# EAGLE design dc_q84_v2 v1 (EAGLE 9.7.0)
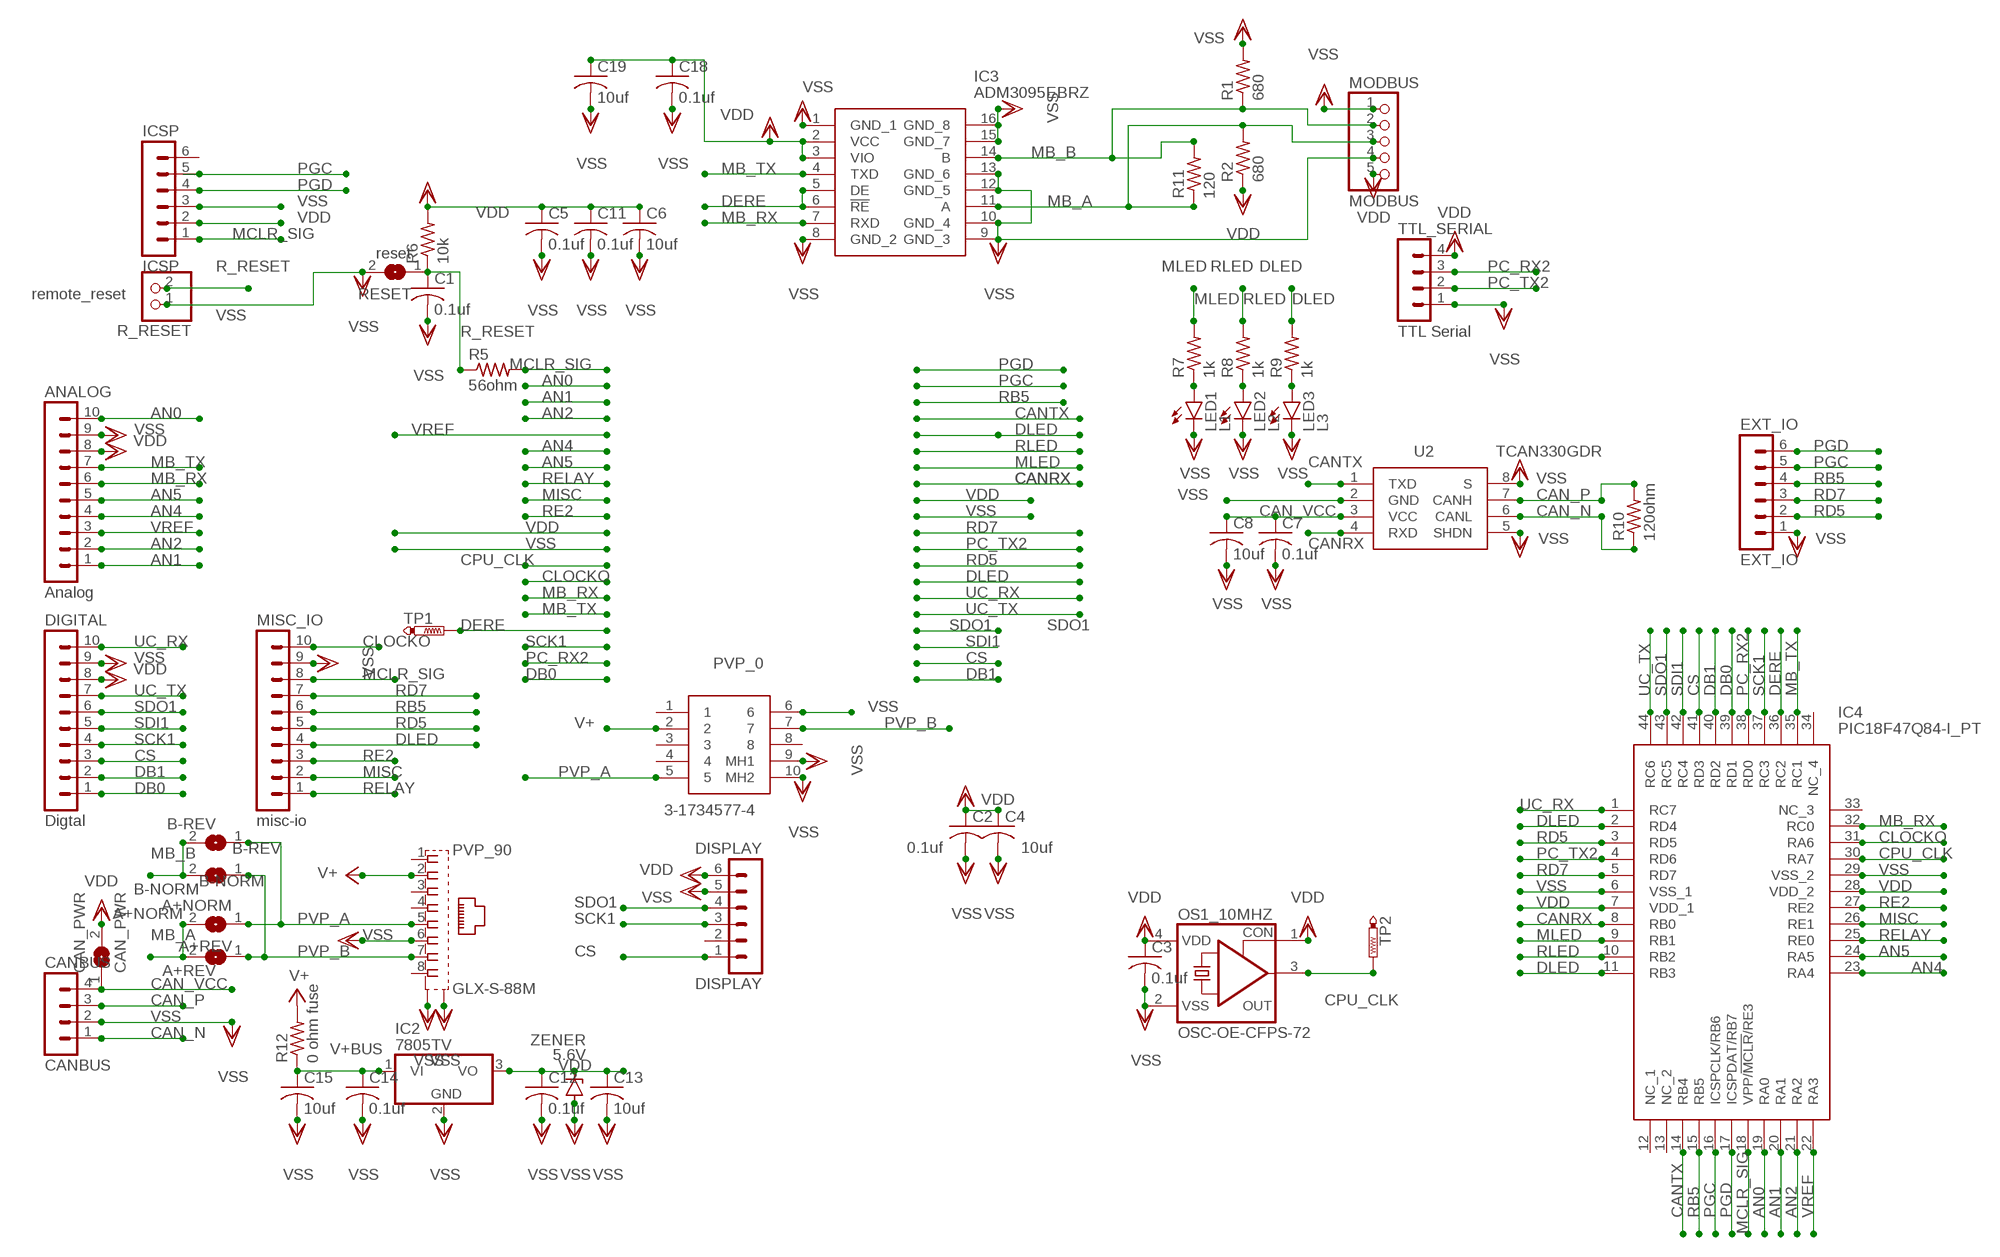
[diagram p0: schematic, sheet 1]

## Parts
A+NORM  A+NORM  SJ  [SJ]
A+REV  A+REV  SJ  [SJ]
ANALOG  Analog  MA10-1  [MA10-1]
B-NORM  B-NORM  SJ  [SJ]
B-REV  B-REV  SJ  [SJ]
C1  0.1uf  C-USC0805  [C0805]
C2  0.1uf  C-USC0805  [C0805]
C3  0.1uf  C-USC0805  [C0805]
C4  10uf  C-USC0805  [C0805]
C5  0.1uf  C-USC0805  [C0805]
C6  10uf  C-USC0805  [C0805]
C7  0.1uf  C-USC0805  [C0805]
C8  10uf  C-USC0805  [C0805]
C11  0.1uf  C-USC0805  [C0805]
C12  0.1uf  C-USC0805  [C0805]
C13  10uf  C-USC0805  [C0805]
C14  0.1uf  C-USC0805  [C0805]
C15  10uf  C-USC0805  [C0805]
C18  0.1uf  C-USC0805  [C0805]
C19  10uf  C-USC0805  [C0805]
CAN_PWR  CAN_PWR  SJ  [SJ]
CANBUS  CANBUS  MA04-1  [MA04-1]
DIGITAL  Digtal  MA10-1  [MA10-1]
DISPLAY  DISPLAY  MA06-1  [MA06-1]
EXT_IO  EXT_IO  MA06-1  [MA06-1]
IC2  7805TV  [TO220V]
IC3  ADM3095EBRZ  [SOIC127P600X175-16N]
IC4  PIC18F47Q84-I_PT  [QFP80P1200X1200X120-44N]
ICSP  ICSP  MA06-1  [MA06-1]
LED1  L1  LEDCHIPLED_0805  [CHIPLED_0805]
LED2  L2  LEDCHIPLED_0805  [CHIPLED_0805]
LED3  L3  LEDCHIPLED_0805  [CHIPLED_0805]
MISC_IO  misc-io  MA10-1  [MA10-1]
MODBUS  MODBUS  PINHD-1X5  [1X05]
OS1_10MHZ  OSC-OE-CFPS-72  [7.2X5.2-4-PAD]
PVP_0  3-1734577-4  [317345774]
PVP_90  GLX-S-88M  [GLX-S-88M]
R1  680  R-US_R0805  [R0805]
R2  680  R-US_R0805  [R0805]
R5  56ohm  R-US_R0805  [R0805]
R6  10k  R-US_R0805  [R0805]
R7  1k  R-US_R0805  [R0805]
R8  1k  R-US_R0805  [R0805]
R9  1k  R-US_R0805  [R0805]
R10  120ohm  R-US_R0805  [R0805]
R11  120  R-US_R0805  [R0805]
R12  0 ohm fuse  R-US_R1206  [R1206]
R_RESET  remote_reset  PINHD-1X2  [1X02]
RESET  reset  SJ  [SJ]
TP1  PTR1PAD1-13  [P1-13]
TP2  PTR1PAD1-13  [P1-13]
TTL_SERIAL  TTL Serial  MA04-1  [MA04-1]
U2  TCAN330GDR  [SOIC127P600X175-8N]
ZENER  5.6V  ZENER-DIODESMB  [SMB]

## Nets
AN0: ANALOG.10 IC4.19(RA0)
AN1: ANALOG.1 IC4.20(RA1)
AN2: ANALOG.2 IC4.21(RA2)
AN4: ANALOG.4 IC4.23(RA4)
AN5: ANALOG.5 IC4.24(RA5)
CAN_N: CANBUS.1 R10.1 U2.6(CANL)
CAN_P: CANBUS.3 R10.2 U2.7(CANH)
CAN_VCC [icurrent]: C7.1 C8.1 CAN_PWR.1 CANBUS.4 U2.3(VCC)
CANRX: IC4.8(RB0) U2.4(RXD)
CANTX: IC4.14(RB4) U2.1(TXD)
CLOCKO: IC4.31(RA6) MISC_IO.10
CPU_CLK: IC4.30(RA7) OS1_10MHZ.3(OUT) TP2.TP
CS: DIGITAL.3 DISPLAY.1 IC4.41(RD3)
DB0: DIGITAL.1 IC4.39(RD1)
DB1: DIGITAL.2 IC4.40(RD2)
DERE: IC3.5(DE) IC3.6(!RE) IC4.36(RC2) TP1.TP
DLED: IC4.2(RD4) IC4.11(RB3) MISC_IO.4 R9.2
MB_A: A+NORM.2 A+REV.2 IC3.11(A) MODBUS.3 R2.2 R11.1
MB_B: B-NORM.2 B-REV.2 IC3.14(B) MODBUS.2 R1.1 R11.2
MB_RX: ANALOG.6 IC3.7(RXD) IC4.32(RC0)
MB_TX: ANALOG.7 IC3.4(TXD) IC4.35(RC1)
MCLR_SIG: IC4.18(VPP/!MCLR!/RE3) ICSP.1 MISC_IO.8 R5.2
MISC: IC4.26(RE1) MISC_IO.2
MLED: IC4.9(RB1) R7.2
N$4: LED1.A R7.1
N$5: LED2.A R8.1
N$6: LED3.A R9.1
PC_RX2: IC4.38(RD0) TTL_SERIAL.3
PC_TX2: IC4.4(RD6) TTL_SERIAL.2
PGC: EXT_IO.5 IC4.16(ICSPCLK/RB6) ICSP.5
PGD: EXT_IO.6 IC4.17(ICSPDAT/RB7) ICSP.4
PVP_A: A+NORM.1 B-REV.1 PVP_0.5 PVP_90.5
PVP_B: A+REV.1 B-NORM.1 PVP_0.7 PVP_90.7
R_RESET: C1.1 R5.1 R6.1 R_RESET.2 RESET.1
RB5: EXT_IO.4 IC4.15(RB5) MISC_IO.6
RD5: EXT_IO.2 IC4.3(RD5) MISC_IO.5
RD7: EXT_IO.3 IC4.5(RD7) MISC_IO.7
RE2: IC4.27(RE2) MISC_IO.3
RELAY: IC4.25(RE0) MISC_IO.1
RLED: IC4.10(RB2) R8.2
SCK1: DIGITAL.4 DISPLAY.3 IC4.37(RC3)
SDI1: DIGITAL.5 IC4.42(RC4)
SDO1: DIGITAL.6 DISPLAY.4 IC4.43(RC5)
UC_RX: DIGITAL.10 IC4.1(RC7)
UC_TX: DIGITAL.7 IC4.44(RC6)
V+ [icurrent]: PVP_0.2 PVP_90.2 R12.2
V+BUS [icurrent]: C14.1 C15.1 IC2.1(VI) R12.1
VDD [icurrent]: ANALOG.8 C2.1 C3.1 C4.1 C5.1 C6.1 C11.1 C12.1 C13.1 C18.1 C19.1 CAN_PWR.2 DIGITAL.8 DISPLAY.6 IC2.3(VO) IC3.2(VCC) IC3.3(VIO) IC4.7(VDD_1) IC4.28(VDD_2) ICSP.2 MODBUS.5 OS1_10MHZ.1(CON) OS1_10MHZ.4(VDD) R2.1 R6.2 TTL_SERIAL.4 ZENER.C
VREF: ANALOG.3 IC4.22(RA3)
VSS [icurrent]: ANALOG.9 C1.2 C2.2 C3.2 C4.2 C5.2 C6.2 C7.2 C8.2 C11.2 C12.2 C13.2 C14.2 C15.2 C18.2 C19.2 CANBUS.2 DIGITAL.9 DISPLAY.5 EXT_IO.1 IC2.2(GND) IC3.1(GND_1) IC3.8(GND_2) IC3.9(GND_3) IC3.10(GND_4) IC3.12(GND_5) IC3.13(GND_6) IC3.15(GND_7) IC3.16(GND_8) IC4.6(VSS_1) IC4.29(VSS_2) ICSP.3 LED1.C LED2.C LED3.C MISC_IO.9 MODBUS.1 MODBUS.4 OS1_10MHZ.2(VSS) PVP_0.6 PVP_0.9(MH1) PVP_0.10(MH2) PVP_90.6 PVP_90.S1 PVP_90.S2 R1.2 R_RESET.1 RESET.2 TTL_SERIAL.1 U2.2(GND) U2.5(SHDN) U2.8(S) ZENER.A
Unconnected: DISPLAY.2 IC4.12(NC_1) IC4.13(NC_2) IC4.33(NC_3) IC4.34(NC_4) ICSP.6 PVP_0.1 PVP_0.3 PVP_0.4 PVP_0.8 PVP_90.1 PVP_90.3 PVP_90.4 PVP_90.8

## Library data of the parts
A+NORM A+REV B-NORM B-REV CAN_PWR RESET = jumper:SJ: SMD solder JUMPER
ANALOG DIGITAL MISC_IO = con-lstb:MA10-1: PIN HEADER; OC_FARNELL: unknown; OC_NEWARK: unknown
C1-C8 C11-C15 C18 C19 = rcl:C-US: CAPACITOR, American symbol; SPICEPREFIX: C
CANBUS TTL_SERIAL = con-lstb:MA04-1: PIN HEADER; OC_FARNELL: unknown; OC_NEWARK: unknown
DISPLAY EXT_IO ICSP = con-lstb:MA06-1: PIN HEADER; OC_FARNELL: unknown; OC_NEWARK: unknown
IC2 = linear:78*: Positive VOLTAGE REGULATOR Source: http://cache.national.com/ds/LM/LM78L05.pdf http://www.fairchildsemi.com/ds/LM/LM7805.pdf
IC3 = ADM3095EBRZ:ADM3095EBRZ: Level 4 EMC Protected RS-485 Transceiver with Full +/-42 V Fault Protection Source: Datasheet <https://componentsearchengine.com/Datasheets/1/ADM3095EBRZ.pdf>; DESCRIPTION: Level 4 EMC Protected RS-485 Transceiver with Full +/-42 V Fault Protection; HEIGHT: 1.75mm; MANUFACTURER_NAME: Analog Devices; MANUFACTURER_PART_NUMBER: ADM3095EBRZ; MOUSER_PART_NUMBER: 584-ADM3095EBRZ; MOUSER_PRICE-STOCK: https://www.mouser.com/Search/Refine.aspx?Keyword=584-ADM3095EBRZ
IC4 = PIC18F47Q84-I_PT:PIC18F47Q84-I_PT: 8-bit Microcontrollers - MCU CAN-FD, 128KB Flash, 13KB RAM, 12b ADC3, UTMR, DAC, Comp, PWM, CCP, CWG, HLT, WWDT, SCAN/CRC, ZCD, PPS,Comms IDLE/DOZE/PMD, JTAG Source: Datasheet <https://ww1.microchip.com/downloads/en/DeviceDoc/PIC18F27-47-57Q84-Data-Sheet-40002213D.pdf>; DESCRIPTION: 8-bit Microcontrollers - MCU CAN-FD, 128KB Flash, 13KB RAM, 12b ADC3, UTMR, DAC, Comp, PWM, CCP, CWG, HLT, WWDT, SCAN/CRC, ZCD, PPS,Comms IDLE/DOZE/PMD, JTAG; HEIGHT: 1.2mm; MANUFACTURER_NAME: Microchip; MANUFACTURER_PART_NUMBER: PIC18F47Q84-I/PT; MOUSER_PART_NUMBER: 579-PIC18F47Q84-I/PT; MOUSER_PRICE-STOCK: https://www.mouser.co.uk/ProductDetail/Microchip-Technology/PIC18F47Q84-I-PT?qs=d0WKAl%252BL4KYthTnAmf%2FYSg%3D%3D
LED1-LED3 = led:LED: LED OSRAM: - CHIPLED LG R971, LG N971, LY N971, LG Q971, LY Q971, LO R971, LY R971 LH N974, LH R974 LS Q976, LO Q976, LY Q976 LO Q996 - Hyper CHIPLED LW Q18S LB Q993, LB Q99A, LB R99A - SideLED LS A670, LO A670, LY A670, LG A670, LP A670 LB A673, LV A673, LT A673, LW A673 LH A674 LY A675 LS A676, LA A676, LO A676, LY A676, LW A676 LS A679, LY A679, LG A679 - Hyper Micro SIDELED® LS Y876, LA Y876, LO Y876, LY Y876 LT Y87S - SmartLED LW L88C, LW L88S LB L89C, LB L89S, LG L890 LS L89K, LO L89K, LY L89K LS L896, LA L896, LO L896, LY L896 - TOPLED LS T670, LO T670, LY T670, LG T670, LP T670 LSG T670, LSP T670, LSY T670, LOP T670, LYG T670 LG T671, LOG T671, LSG T671 LB T673, LV T673, LT T673, LW T673 LH T674 LS T676, LA T676, LO T676, LY T676, LB T676, LH T676, LSB T676, LW T676 LB T67C, LV T67C, LT T67C, LS T67K, LO T67K, LY T67K, LW E67C LS E67B, LA E67B, LO E67B, LY E67B, LB E67C, LV E67C, LT E67C LW T67C LS T679, LY T679, LG T679 LS T770, LO T770, LY T770, LG T770, LP T770 LB T773, LV T773, LT T773, LW T773 LH T774 LS E675, LA E675, LY E675, LS T675 LS T776, LA T776, LO T776, LY T776, LB T776 LHGB T686 LT T68C, LB T68C - Hyper Mini TOPLED® LB M676 - Mini TOPLED Santana® LG M470 LS M47K, LO M47K, LY M47K Source: http://www.osram.convergy.de LUXEON: - LUMILED® LXK2-PW12-R00, LXK2-PW12-S00, LXK2-PW14-U00, LXK2-PW14-V00 LXK2-PM12-R00, LXK2-PM12-S00, LXK2-PM14-U00 LXK2-PE12-Q00, LXK2-PE12-R00, LXK2-PE12-S00, LXK2-PE14-T00, LXK2-PE14-U00 LXK2-PB12-K00, LXK2-PB12-L00, LXK2-PB12-M00, LXK2-PB14-N00, LXK2-PB14-P00, LXK2-PB14-Q00 LXK2-PR12-L00, LXK2-PR12-M00, LXK2-PR14-Q00, LXK2-PR14-R00 LXK2-PD12-Q00, LXK2-PD12-R00, LXK2-PD12-S00 LXK2-PH12-R00, LXK2-PH12-S00 LXK2-PL12-P00, LXK2-PL12-Q00, LXK2-PL12-R00 Source: www.luxeon.com KINGBRIGHT: KA-3528ASYC Source: www.kingbright.com
MODBUS = pinhead:PINHD-1X5: PIN HEADER
OS1_10MHZ = IQD-Frequency-Products:OSC-OE: OSCILLATOR WITH OE
PVP_0 = 3-1734577-4:3-1734577-4: RJ45 Connector, Single Port, 1 x 1, Standard Connector Contact Density, Jack, Shielded, Cat 3, Standard - Latch Down, 8 Position, Standard Profile Source: Datasheet <https://www.te.com/commerce/DocumentDelivery/DDEController?Action=showdoc&DocId=Customer Drawing1734577D1pdfEnglishENG_CD_1734577_D1.pdf3-1734577-4>; DESCRIPTION: RJ45 Connector, Single Port, 1 x 1, Standard Connector Contact Density, Jack, Shielded, Cat 3, Standard - Latch Down, 8 Position, Standard Profile; HEIGHT: 16.8mm; MANUFACTURER_NAME: TE Connectivity; MANUFACTURER_PART_NUMBER: 3-1734577-4; MOUSER_PART_NUMBER: 571-3-1734577-4; MOUSER_PRICE-STOCK: https://www.mouser.co.uk/ProductDetail/TE-Connectivity-AMP/3-1734577-4?qs=Z4JOKa0a9TUSCOA052xCCw%3D%3D
PVP_90 = con-kycon:GLX-S-88M: Mod. Jack, Right Angle, 8 posiotion, 8 contatcs RJ45 Source: GLX-S-88M.pdf; OC_FARNELL: unknown; OC_NEWARK: unknown
R1 R2 R5-R12 = rcl:R-US_: RESISTOR, American symbol; SPICEPREFIX: R
R_RESET = pinhead:PINHD-1X2: PIN HEADER
TP1 TP2 = testpad:PTR1: TEST PIN
U2 = TCAN330GDR:TCAN330GDR: 3.3-V CAN Transceivers with CAN FD (Flexible Data Rate) Source: Datasheet <http://www.ti.com/lit/gpn/TCAN330G>; DESCRIPTION: 3.3-V CAN Transceivers with CAN FD (Flexible Data Rate); HEIGHT: 1.75mm; MANUFACTURER_NAME: Texas Instruments; MANUFACTURER_PART_NUMBER: TCAN330GDR; MOUSER_PART_NUMBER: 595-TCAN330GDR; MOUSER_PRICE-STOCK: https://www.mouser.co.uk/ProductDetail/Texas-Instruments/TCAN330GDR?qs=9DwIlvx97adeWwzxdqwSPw%3D%3D
ZENER = diode:ZENER-DIODE: Z-Diode

## Net classes
1 icurrent: width 0.305 mm

## Board
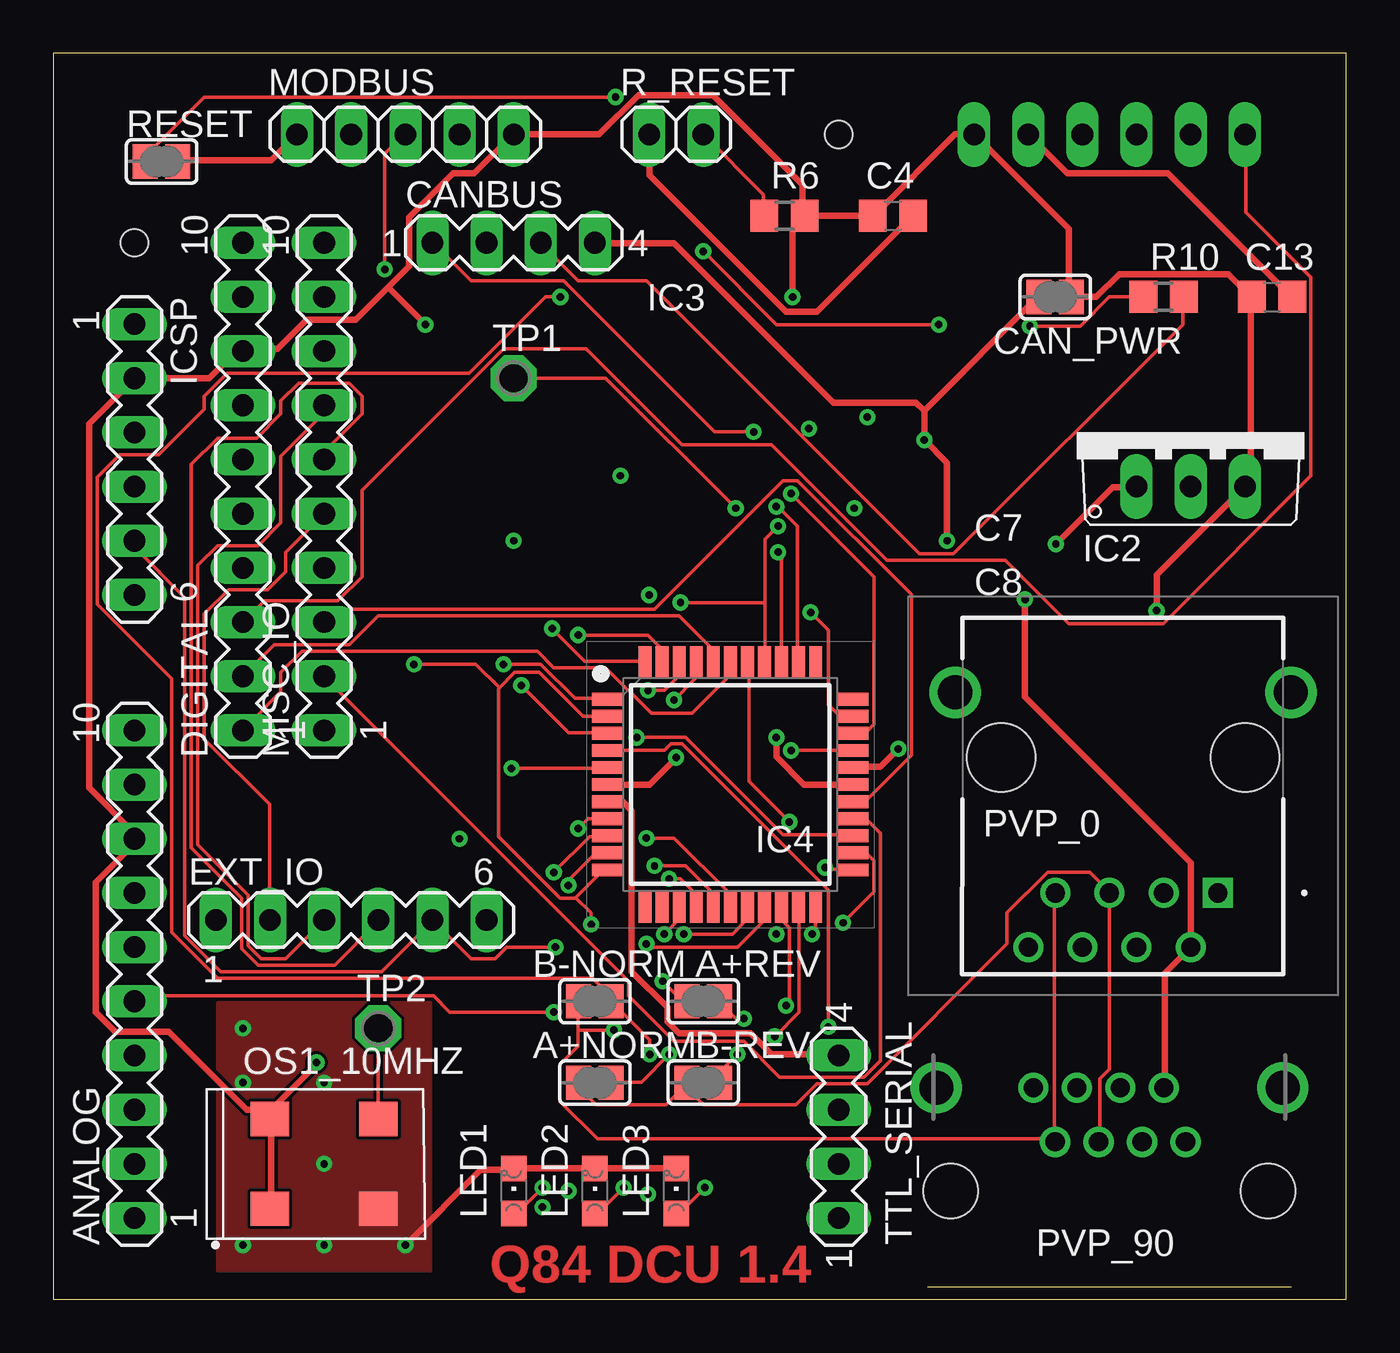
[diagram p1: board, top side]
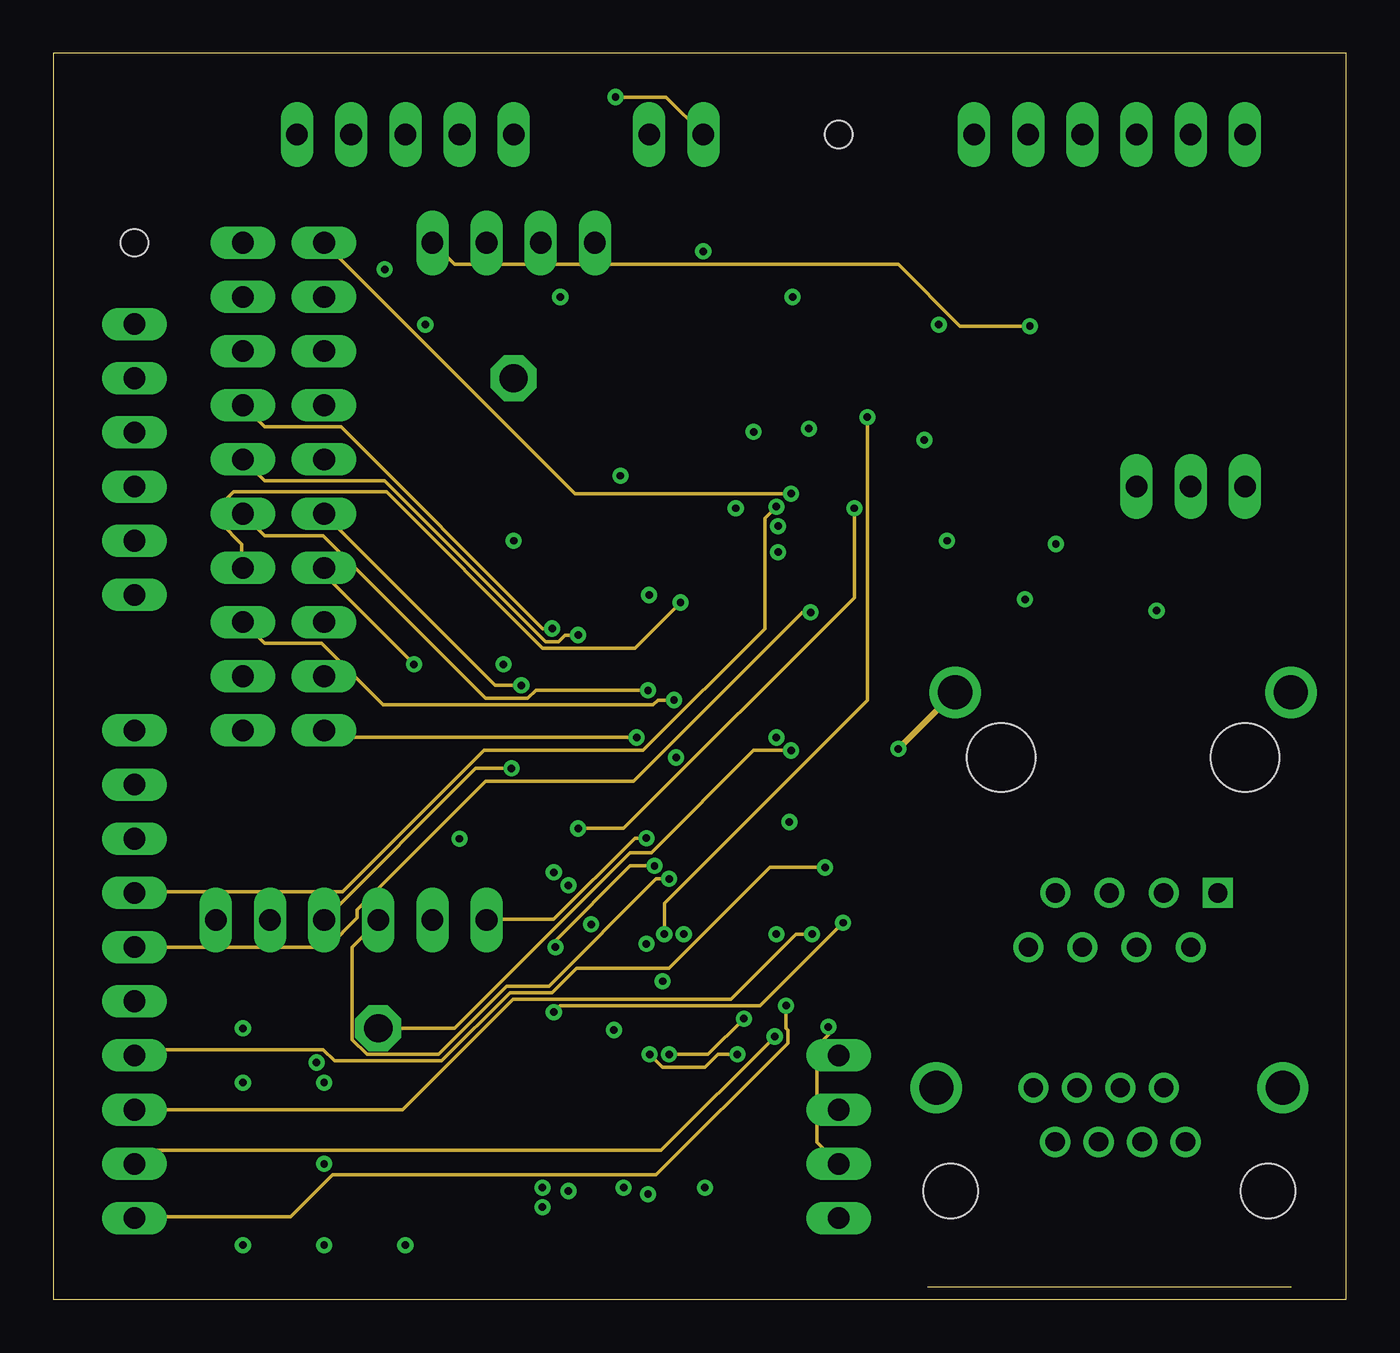
[diagram p2: board, inner layer Route2]
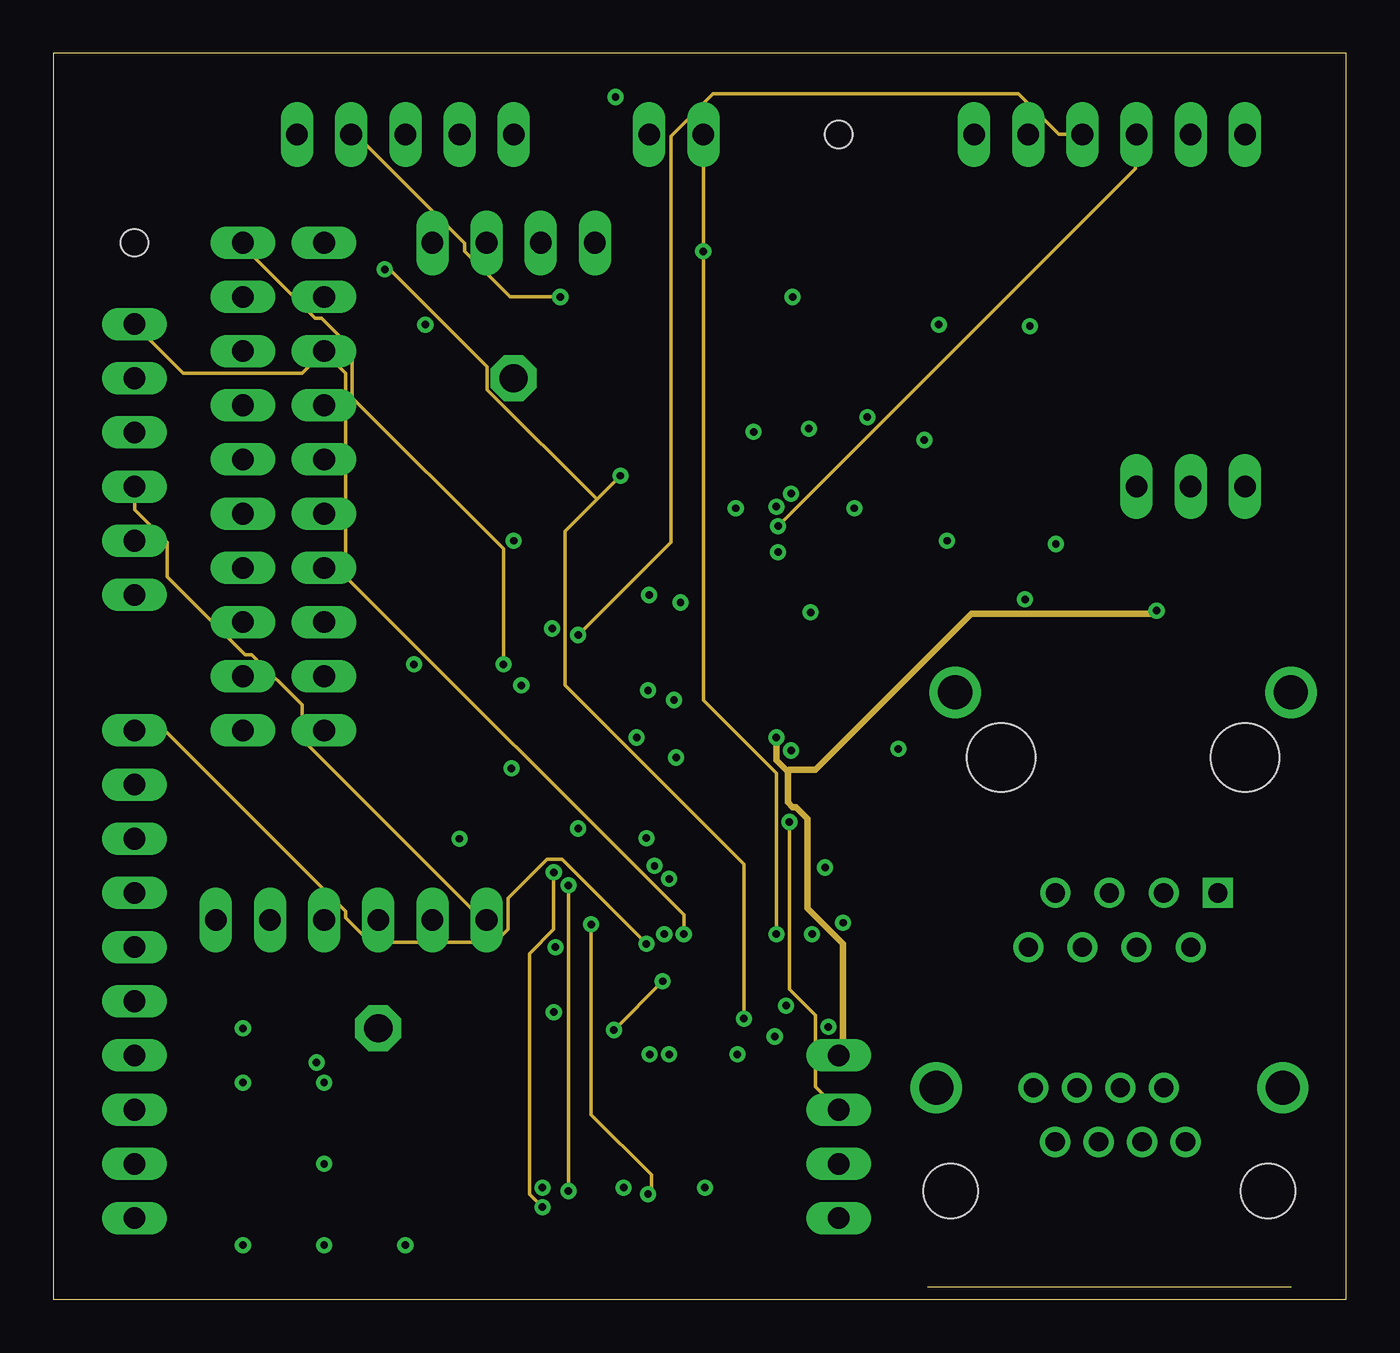
[diagram p3: board, inner layer Route15]
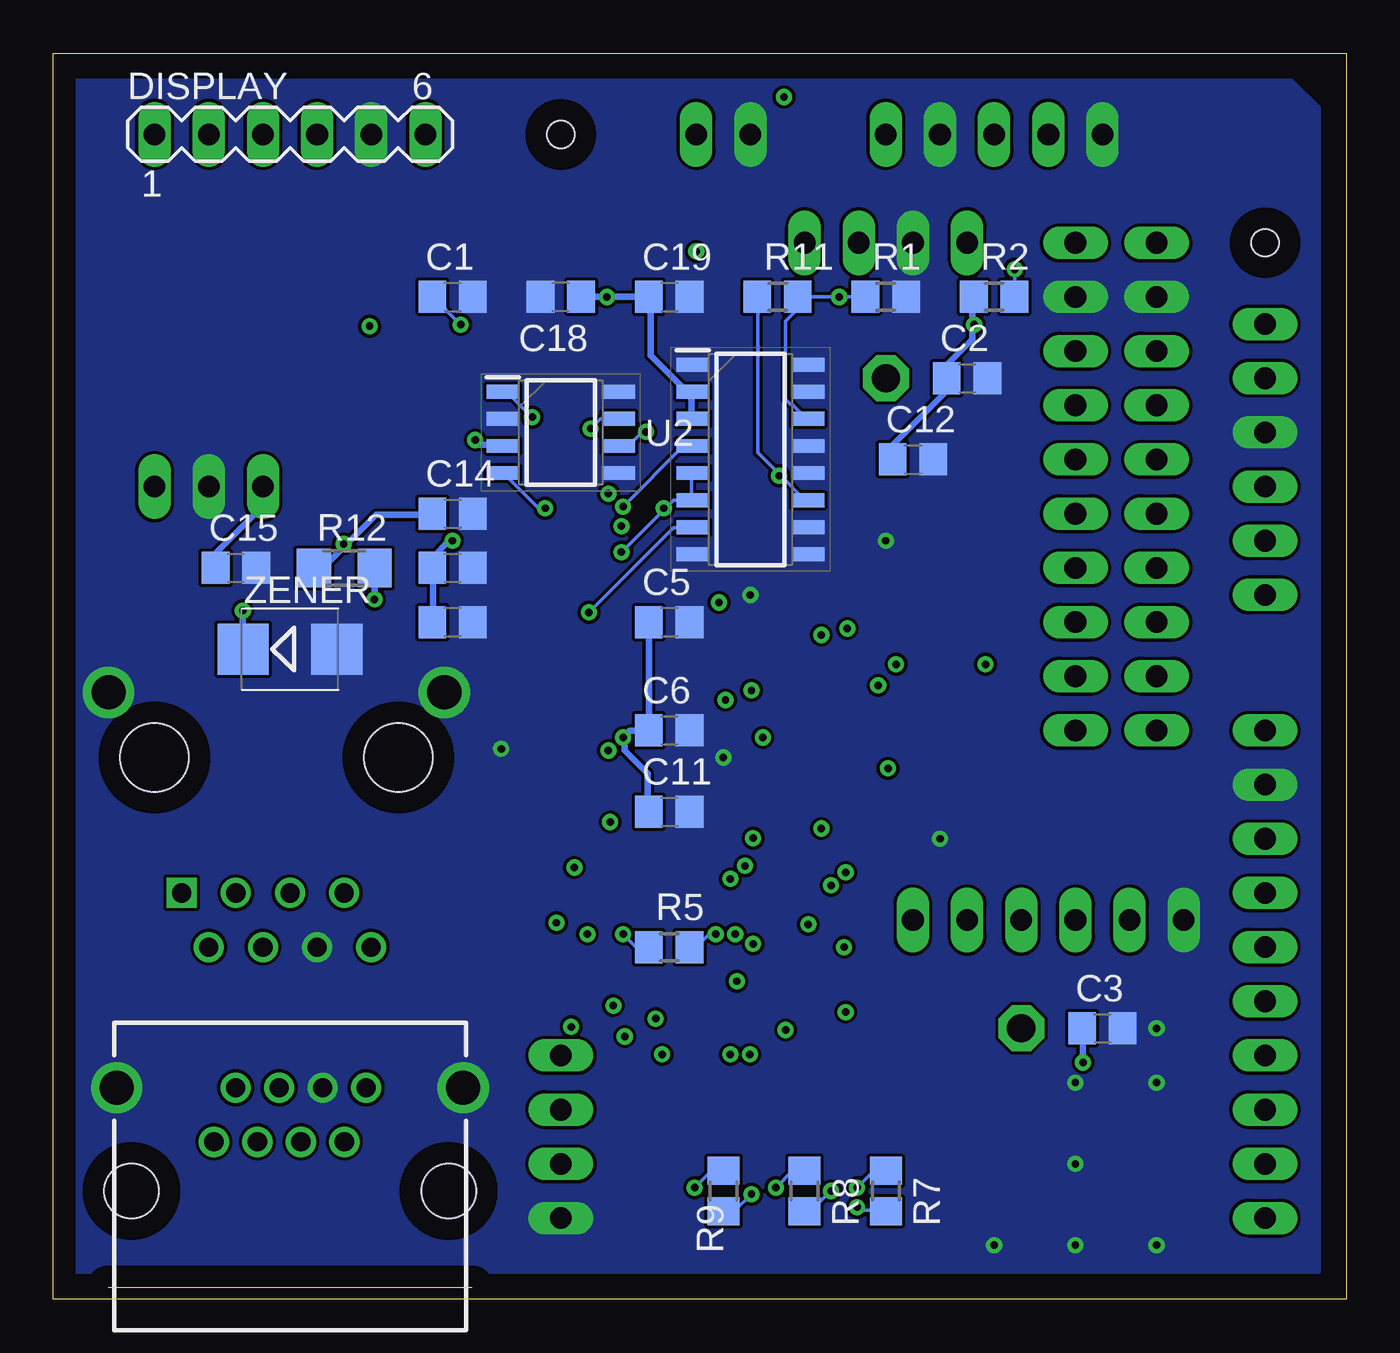
[diagram p4: board, bottom side, seen from below]

Size 60.63 x 58.41 mm. Coordinates in mm from the lower left corner, seen from the top.
Outline: 0,0 60.63,0 60.63,58.41 0,58.41 0,0
Copper layers (1+2*15+16): Top 0.035mm / dielectric 1.5mm / Route2 0.035mm / dielectric 0.15mm / Route15 0.035mm / dielectric 0.2mm / Bottom 0.035mm
Design rules "Fusion Electronics Design Rules *": minimum track width 6mil, minimum drill 0.35mm, track to track 6mil, track to pad 6mil, pad to pad 6mil, via to via 6mil, smd to smd 6mil, copper to edge 40mil, drill to drill 6mil, minimum pad ring 10mil, minimum via ring 8mil, stop-mask expansion 4mil, vias tented up to drill 0mil, thermal gap 10mil
Holes 1.27 mm at 36.83,54.61 3.81,49.53

### Footprints (pad centres in the part's own frame; a part is rotated, then mirrored left to right if it is on the bottom)
SJ = smd 1.168 x 1.6: 1 -0.762,0; 2 0.762,0
MA10-1 = drill 1.016 long: 1 -11.43,0; 2 -8.89,0; 3 -6.35,0; 4 -3.81,0; 5 -1.27,0; 6 1.27,0; 7 3.81,0; 8 6.35,0; 9 8.89,0; 10 11.43,0
C0805 = smd 1.3 x 1.5: 1 -0.95,0; 2 0.95,0
MA04-1 = drill 1.016 long: 1 -3.81,0; 2 -1.27,0; 3 1.27,0; 4 3.81,0
MA06-1 = drill 1.016 long: 1 -6.35,0; 2 -3.81,0; 3 -1.27,0; 4 1.27,0; 5 3.81,0; 6 6.35,0
TO220V = drill 1.016 long: 1 -2.54,-2.54; 2 0,-2.54; 3 2.54,-2.54
SOIC127P600X175-16N = smd 1.525 x 0.65: 1 -2.712,4.445; 2 -2.712,3.175; 3 -2.712,1.905; 4 -2.712,0.635; 5 -2.712,-0.635; 6 -2.712,-1.905; 7 -2.712,-3.175; 8 -2.712,-4.445; 9 2.712,-4.445; 10 2.712,-3.175; 11 2.712,-1.905; 12 2.712,-0.635; 13 2.712,0.635; 14 2.712,1.905; 15 2.712,3.175; 16 2.712,4.445
QFP80P1200X1200X120-44N = smd 1.475 x 0.6: 1 -5.738,4; 2 -5.738,3.2; 3 -5.738,2.4; 4 -5.738,1.6; 5 -5.738,0.8; 6 -5.738,0; 7 -5.738,-0.8; 8 -5.738,-1.6; 9 -5.738,-2.4; 10 -5.738,-3.2; 11 -5.738,-4; 23 5.738,-4; 24 5.738,-3.2; 25 5.738,-2.4; 26 5.738,-1.6; 27 5.738,-0.8; 28 5.738,0; 29 5.738,0.8; 30 5.738,1.6; 31 5.738,2.4; 32 5.738,3.2; 33 5.738,4 | smd 0.6 x 1.475: 12 -4,-5.738; 13 -3.2,-5.738; 14 -2.4,-5.738; 15 -1.6,-5.738; 16 -0.8,-5.738; 17 0,-5.738; 18 0.8,-5.738; 19 1.6,-5.738; 20 2.4,-5.738; 21 3.2,-5.738; 22 4,-5.738; 34 4,5.738; 35 3.2,5.738; 36 2.4,5.738; 37 1.6,5.738; 38 0.8,5.738; 39 0,5.738; 40 -0.8,5.738; 41 -1.6,5.738; 42 -2.4,5.738; 43 -3.2,5.738; 44 -4,5.738
CHIPLED_0805 = smd 1.2 x 1.2: A 0,-1.05; C 0,1.05
1X05 = drill 1.016 long: 1 -5.08,0; 2 -2.54,0; 3 0,0; 4 2.54,0; 5 5.08,0
7.2X5.2-4-PAD = smd 1.8 x 1.6: 1 -2.54,-2.1; 2 2.54,-2.1; 3 2.54,2.1; 4 -2.54,2.1
317345774 = drill 0.9 pad 1.4 square: 1 0,0 | drill 0.9 pad 1.4: 2 -1.27,-2.54; 3 -2.54,0; 4 -3.81,-2.54; 5 -5.08,0; 6 -6.35,-2.54; 7 -7.62,0; 8 -8.89,-2.54 | drill 1.6 pad 2.4: 9 3.43,9.4; 10 -12.32,9.4 | hole 3.2: 1.27,6.35; -10.16,6.35
GLX-S-88M = drill 0.9 pad 1.422: 1 -3.57,-2.3; 2 -2.55,-4.84; 3 -1.53,-2.3; 4 -0.51,-4.84; 5 0.51,-2.3; 6 1.53,-4.84; 7 2.55,-2.3; 8 3.57,-4.84 | drill 1.6 pad 2.184: S1 -8.125,-4.84; S2 8.125,-4.84 | hole 2.55: -7.44,0; 7.44,0
R0805 = smd 1.3 x 1.5: 1 -0.95,0; 2 0.95,0
R1206 = smd 1.6 x 1.803: 1 -1.422,0; 2 1.422,0
1X02 = drill 1.016 long: 1 -1.27,0; 2 1.27,0
P1-13 = drill 1.321 pad 2.159 octagon: TP 0,0
SOIC127P600X175-8N = smd 1.528 x 0.65: 1 -2.711,1.905; 2 -2.711,0.635; 3 -2.711,-0.635; 4 -2.711,-1.905; 5 2.711,-1.905; 6 2.711,-0.635; 7 2.711,0.635; 8 2.711,1.905
SMB = smd 2.4 x 2.4: A 2.2,0; C -2.2,0

### Placement (x,y rotation side)
A+NORM  25.4,10.16 0 top
A+REV  30.48,13.97 0 top
ANALOG  3.81,15.24 90 top
B-NORM  25.4,13.97 0 top
B-REV  30.48,10.16 0 top
C1  41.91,46.99 0 bottom
C2  17.78,43.18 0 bottom
C3  11.43,12.7 0 bottom
C4  39.37,50.8 0 top
C5  31.75,31.75 0 bottom
C6  31.75,26.67 0 bottom
C7  41.91,34.29 0 bottom
C8  41.91,31.75 0 bottom
C11  31.75,22.86 0 bottom
C12  20.32,39.37 0 bottom
C13  57.15,46.99 0 top
C14  41.91,36.83 0 bottom
C15  52.07,34.29 0 bottom
C18  36.83,46.99 180 bottom
C19  31.75,46.99 0 bottom
CAN_PWR  46.99,46.99 0 top
CANBUS  21.59,49.53 0 top
DIGITAL  8.89,38.1 90 top
DISPLAY  49.53,54.61 0 bottom
EXT_IO  13.97,17.78 0 top
IC2  53.34,40.64 0 top
IC3  27.94,39.37 0 bottom
IC4  31.75,24.13 0 top
ICSP  3.81,39.37 270 top
LED1  21.59,5.08 0 top
LED2  25.4,5.08 0 top
LED3  29.21,5.08 0 top
MISC_IO  12.7,38.1 90 top
MODBUS  16.51,54.61 0 top
OS1_10MHZ  12.7,6.35 0 top
PVP_0  54.61,19.05 0 top
PVP_90  49.53,5.08 180 top
R1  21.59,46.99 0 bottom
R2  16.51,46.99 0 bottom
R5  31.75,16.51 0 bottom
R6  34.29,50.8 0 top
R7  21.59,5.08 270 bottom
R8  25.4,5.08 270 bottom
R9  29.21,5.08 270 bottom
R10  52.07,46.99 0 top
R11  26.67,46.99 0 bottom
R12  46.99,34.29 0 bottom
R_RESET  29.21,54.61 0 top
RESET  5.08,53.34 0 top
TP1  21.59,43.18 0 top
TP2  15.24,12.7 0 top
TTL_SERIAL  36.83,7.62 90 top
U2  36.83,40.64 0 bottom
ZENER  49.53,30.48 0 bottom

### Tracks (layer width: path | path; a pad name or v marks a point on that pad's centre or on a via)
AN0  (via drill 0.35)
  Top 0.152: v27.81,16.66 27.96,16.51 32.08,16.51 33.3,17.73 33.3,18.34 IC4.19
  Route15 0.152: v27.81,16.66 23.85,20.63 23.16,20.63 21.34,18.8 21.34,17.35 20.73,16.74 14.86,16.74 13.72,17.88 13.72,18.19 5.26,26.64 3.81,26.64 ANALOG.10
AN1  (via drill 0.35)
  Top 0.152: v34.37,13.77 34.52,13.92 34.52,17.42 34.21,17.73 34.21,18.34 IC4.20
  Route2 0.152: v34.37,13.77 34.37,12.7 34.44,12.62 34.44,12.01 28.27,5.84 13.11,5.84 11.12,3.86 3.81,3.86 ANALOG.1
AN2  (via drill 0.35)
  Top 0.152: v33.83,12.32 34.98,13.46 34.98,18.34 IC4.21
  Route2 0.152: v33.83,12.32 28.5,6.98 4.42,6.98 3.81,6.38 ANALOG.2
AN4  (via drill 0.35)
  Top 0.152: v36.2,20.24 36.27,20.17 37.41,20.17 IC4.23
  Route2 0.152: v36.2,20.24 33.6,20.24 28.88,15.52 24.54,15.52 23.39,14.38 21.41,14.38 18.21,11.18 13.18,11.18 12.65,11.71 4.04,11.71 3.81,11.48 ANALOG.4
AN5  (via drill 0.35)
  Top 0.152: v37.03,17.65 38.48,19.1 38.48,20.55 38.1,20.93 IC4.24 | v23.47,13.46 18.59,13.46 17.83,14.22 4.04,14.22 3.81,14 ANALOG.5
  Route2 0.152: v37.03,17.65 33.15,13.77 23.77,13.77 v23.47,13.46
CAN_N  (via drill 0.35)
  Top 0.152: R10.1 49.53,46.99 48.16,45.62 v45.8,45.62 | v32.84,40.67 31.01,40.67 23.93,47.75 19.58,47.75 17.83,49.5 CANBUS.1
  Route2 0.152: v45.8,45.62 42.52,45.62 39.62,48.51 18.82,48.51 17.83,49.5 CANBUS.1
  Bottom 0.152: v32.84,40.67 32.99,40.67 33.6,40.06 34.06,40.06 U2.6
CAN_P  (via drill 0.35)
  Top 0.152: 35.09,40.47 27.81,47.75 24.61,47.75 22.86,49.5 CANBUS.3 | 35.09,40.47 40.62,34.95 42.22,34.95 52.96,45.69 52.96,46.99 R10.2 | 35.09,40.47 v35.43,40.82
  Bottom 0.152: U2.7 34.98,41.28 v35.43,40.82
CAN_VCC  (via drill 0.35)
  Top 0.305: 40.84,41.66 v40.84,40.28 41.91,39.22 v41.91,35.56 | 40.84,41.66 46.18,46.99 CAN_PWR.1 | 40.84,41.66 40.46,42.04 36.58,42.04 29.11,49.5 25.45,49.5 CANBUS.4
  Bottom 0.305: C8.1 42.82,31.75 42.82,34.27 C7.1 42.82,34.42 42.82,34.8 42.06,35.56 v41.91,35.56 | v40.84,40.28 40.62,40.06 39.55,40.06 U2.3
CANRX  (via drill 0.35)
  Top 0.152: v24.61,22.07 25.07,22.53 25.98,22.53 IC4.8
  Route2 0.152: v24.61,22.07 26.75,22.07 37.57,32.89 v37.57,37.08
  Bottom 0.152: v37.57,37.08 37.87,37.08 39.47,38.68 U2.4
CANTX  (via drill 0.35)
  Top 0.152: v28.65,17.12 29.34,17.81 29.34,18.34 IC4.14
  Route2 0.152: v28.65,17.12 28.65,18.57 38.18,28.09 v38.18,41.35
  Bottom 0.152: v38.18,41.35 39.32,42.49 39.47,42.49 U2.1
CLOCKO  (via drill 0.35)
  Top 0.152: v34.59,37.77 38.48,33.88 38.48,26.95 38.1,26.57 37.49,26.57 IC4.31
  Route2 0.152: v34.59,37.77 24.46,37.77 MISC_IO.10
CPU_CLK  (via drill 0.35)
  Top 0.152: v34.59,25.73 37.41,25.73 IC4.30 | TP2.TP OS1_10MHZ.3
  Route2 0.152: v34.59,25.73 32.84,25.73 28.04,20.93 27.05,20.93 18.82,12.7 TP2.TP
CS  (via drill 0.35)
  Top 0.152: v29.11,28.09 30.1,29.08 30.1,29.85 IC4.41 | DISPLAY.1 55.93,54.61 55.93,50.95 58.98,47.9 58.98,38.61 52.05,31.67 47.62,31.67 44.65,34.65 39.09,34.65 33.68,40.06 29.49,40.06 24.99,44.55 21.11,44.55 14.48,37.92 14.48,33.88 13.34,32.74 9.91,32.74 8.91,31.75 DIGITAL.3
  Route2 0.152: v29.11,28.09 28.35,28.09 28.12,27.86 15.47,27.86 12.57,30.76 9.91,30.76 8.91,31.75 DIGITAL.3
DB0
  Top 0.152: IC4.39 31.7,29.85 31.7,29.24 29.95,27.48 28.04,27.48 25.91,29.62 23.47,29.62 22.71,30.38 11.66,30.38 10.67,29.39 10.67,28.47 8.91,26.72 DIGITAL.1
DB1
  Top 0.152: DIGITAL.2 10.36,30.68 13.87,30.68 15.24,32.06 29.34,32.06 30.94,30.46 30.94,29.92 IC4.40
DERE  (via drill 0.35)
  Top 0.152: v33.98,35.03 34.14,34.87 34.14,29.92 IC4.36 | TP1.TP 25.91,43.18 v32,37.08
  Bottom 0.152: 31.97,37.05 31.55,37.47 30.71,37.47 | 31.97,37.05 v33.98,35.03 | 30.71,37.47 30.71,38.68 IC3.5 | 30.71,37.47 IC3.6 | v32,37.08 31.97,37.05
DLED  (via drill 0.35)
  Top 0.152: 24.5,18.83 24.46,18.8 23.77,18.8 20.88,21.69 20.88,28.63 20.92,28.66 | 24.5,18.83 25.76,20.09 25.98,20.09 IC4.11 | 20.92,28.66 21.64,29.39 22.78,29.39 24.84,27.33 25.98,27.33 IC4.2 | v25.22,17.58 25.22,18.11 24.5,18.83 | v16.92,29.77 19.81,29.77 20.92,28.66
  Route2 0.152: v16.92,29.77 12.72,33.96 12.72,34.27 MISC_IO.4
  Route15 0.152: v27.89,4.93 28.04,5.08 28.04,5.84 25.22,8.66 v25.22,17.58
  Bottom 0.152: v27.89,4.93 28.65,4.17 29.18,4.17 R9.2
MB_A  (via drill 0.35)
  Top 0.152: v15.54,48.28 15.54,53.7 16.46,54.61 MODBUS.3 | v28.88,11.48 27.58,10.18 26.21,10.18 A+NORM.2 | v32.38,13.16 32,13.16 31.24,13.92 A+REV.2
  Route2 0.152: v28.88,11.48 30.71,11.48 v32.38,13.16
  Route15 0.152: v32.38,13.16 32.38,20.4 24,28.78 24,36.02 25.49,37.5 | v26.59,38.61 25.49,37.5 | v15.54,48.28 15.77,48.28 20.34,43.71 20.34,42.65 25.49,37.5
  Bottom 0.152: v15.54,48.28 15.54,46.99 R2.2 | 26.56,38.65 25.38,37.47 IC3.11 | 26.56,38.65 27.58,39.67 27.58,46.99 R11.1 | v26.59,38.61 26.56,38.65
MB_B  (via drill 0.35)
  Top 0.152: B-REV.2 31.24,10.64 v32.08,11.48 | v27.96,11.48 27.96,12.17 B-NORM.2 26.14,14 26.14,14.22 25.3,15.06 7.7,15.06 5.56,17.2 5.56,29.08 2.06,32.59 2.06,38.53 3.12,39.6 4.95,39.6 7.09,41.73 7.09,42.34 8.15,43.41 19.51,43.41 23.09,46.99 v23.77,46.99
  Route2 0.152: v32.08,11.48 31.17,11.48 30.56,10.87 28.57,10.87 v27.96,11.48
  Route15 0.152: MODBUS.2 14.17,54.61 19.28,49.5 19.28,49.12 21.41,46.99 v23.77,46.99
  Bottom 0.152: R1.1 v23.77,46.99 R11.2 25.76,46.99 25.76,46.38 26.29,45.85 26.29,42.19 26.06,41.96 25.98,41.96 25.3,41.28 IC3.14
MB_RX  (via drill 0.35)
  Top 0.152: v35.51,32.21 36.35,31.37 36.35,27.86 36.88,27.33 37.41,27.33 IC4.32
  Route2 0.152: ANALOG.6 12.88,16.51 14.25,17.88 14.25,18.26 20.27,24.28 27.2,24.28 35.13,32.21 v35.51,32.21
  Bottom 0.152: v35.51,32.21 31.55,36.17 30.71,36.17 IC3.7
MB_TX  (via drill 0.35)
  Top 0.152: v33.91,37.16 33.98,37.16 34.9,36.25 34.9,29.92 IC4.35
  Route2 0.152: v33.91,37.16 33.38,36.63 33.38,31.44 27.66,25.73 20.19,25.73 13.56,19.1 3.81,19.1 ANALOG.7
  Bottom 0.152: v33.91,37.16 31.09,39.98 30.71,39.98 IC3.4
MCLR_SIG  (via drill 0.35)
  Top 0.152: v29.57,17.12 31.85,17.12 32.54,17.81 32.54,18.34 IC4.18
  Route15 0.152: v29.57,17.12 29.57,18.03 13.72,33.88 13.72,43.41 12.72,44.4 MISC_IO.8 11.66,43.41 6.1,43.41 3.81,45.69 ICSP.1
  Bottom 0.152: v29.57,17.12 29.87,17.12 30.48,16.51 R5.2
MISC
  Top 0.152: IC4.26 38.1,22.53 38.79,21.84 38.79,11.18 38.02,10.41 34.06,10.41 32.38,12.09 29.11,12.09 26.98,14.22 26.98,14.91 12.72,29.16 MISC_IO.2
MLED  (via drill 0.35)
  Top 0.152: v23.47,20.01 25.15,21.69 25.98,21.69 IC4.9
  Route15 0.152: v23.47,20.01 23.47,17.35 22.33,16.21 22.33,4.93 v22.94,4.32
  Bottom 0.152: v22.94,4.32 22.78,4.17 21.64,4.17 R7.2
N$4  (via drill 0.35)
  Top 0.152: v22.94,5.23 21.79,4.09 21.64,4.09 LED1.A
  Bottom 0.152: v22.94,5.23 22.17,5.99 21.64,5.99 R7.1
N$5  (via drill 0.35)
  Top 0.152: v26.75,5.23 25.6,4.09 25.45,4.09 LED2.A
  Bottom 0.152: v26.75,5.23 25.98,5.99 25.45,5.99 R8.1
N$6  (via drill 0.35)
  Top 0.152: v30.56,5.23 29.41,4.09 29.26,4.09 LED3.A
  Bottom 0.152: v30.56,5.23 29.79,5.99 29.26,5.99 R9.1
PC_RX2  (via drill 0.35)
  Top 0.152: v34.52,22.38 32.61,24.28 32.61,29.85 IC4.38
  Route15 0.152: v34.52,22.38 34.52,14.53 35.74,13.31 35.74,9.96 36.8,8.89 TTL_SERIAL.3
PC_TX2  (via drill 0.35)
  Top 0.152: v36.35,12.78 36.35,19.18 29.49,26.04 28.96,26.04 28.65,25.73 26.06,25.73 IC4.4
  Route2 0.152: v36.35,12.78 36.35,12.39 35.81,11.86 35.81,7.37 TTL_SERIAL.2
PGC  (via drill 0.35)
  Top 0.152: v28.19,20.32 29.64,20.32 30.94,19.03 30.94,18.42 IC4.16 | v23.55,16.51 21.26,16.51 20.73,15.98 19.58,15.98 EXT_IO.5 17.75,17.73 15.39,15.37 7.85,15.37 6.17,17.04 6.17,32.89 3.81,35.25 ICSP.5
  Route2 0.152: v28.19,20.32 27.05,20.32 23.55,16.82 v23.55,16.51
PGD  (via drill 0.35)
  Top 0.152: v27.81,21.61 29.11,21.61 31.7,19.03 31.7,18.42 IC4.17
  Route2 0.152: v27.81,21.61 27.28,21.61 23.47,17.81 20.34,17.81 EXT_IO.6
  Route15 0.152: ICSP.4 3.81,37.01 5.33,35.48 5.33,33.88 8.99,30.23 9.3,30.23 11.66,27.86 11.66,26.26 20.12,17.81 20.27,17.81 EXT_IO.6
PVP_A
  Top 0.152: A+NORM.1 24.69,10.11 24.69,9.88 25.45,9.12 28.73,9.12 29.72,10.11 B-REV.1 29.64,9.96 30.48,9.12 34.82,9.12 35.81,10.11 38.18,10.11 44.73,16.66 44.73,18.11 46.63,20.01 48.62,20.01 49.53,19.1 PVP_0.5 49.53,10.79 49.07,10.34 49.07,7.44 PVP_90.5
PVP_B  (via drill 0.35)
  Top 0.152: 24.61,12.62 24.61,11.86 23.77,11.02 23.77,9.27 25.53,7.52 46.86,7.52 46.94,7.44 PVP_90.7 46.94,7.52 46.94,19.03 PVP_0.7 | 24.61,12.62 24.61,13.92 B-NORM.1 | v28.57,14.91 29.49,14 29.72,14 A+REV.1 | 24.61,12.62 v26.29,12.62
  Route15 0.152: v26.29,12.62 v28.57,14.91
R_RESET  (via drill 0.35)
  Top 0.152: R_RESET.2 33.3,51.79 33.3,50.8 R6.1 | v41.53,45.69 33.91,45.69 v30.48,49.12 | v26.36,56.36 7.09,56.36 4.34,53.62 4.34,53.39 RESET.1
  Route2 0.152: v26.36,56.36 28.73,56.36 R_RESET.2
  Route15 0.152: v33.91,17.12 33.91,24.66 30.48,28.09 v30.48,49.12 R_RESET.2
  Bottom 0.152: R5.1 33.3,16.51 v33.91,17.12 | v41.53,45.69 42.82,46.99 C1.1
RB5  (via drill 0.35)
  Top 0.152: v28.88,19.71 29.41,19.71 30.1,19.03 30.1,18.42 IC4.15 | MISC_IO.6 12.72,39.37 12.72,39.75 14.48,41.5 14.48,42.34 13.87,42.95 11.51,42.95 10.67,42.11 10.67,41.5 9.53,40.36 7.7,40.36 6.48,39.14 6.48,21.16 8.84,18.8 8.84,16.43 9.6,15.67 13.18,15.67 15.24,17.73 EXT_IO.4
  Route2 0.152: v28.88,19.71 28.27,19.71 23.24,14.68 21.26,14.68 18.06,11.48 14.71,11.48 14.02,12.17 14.02,16.51 15.24,17.73 EXT_IO.4
RD5  (via drill 0.35)
  Top 0.152: v21.95,28.78 24.16,26.57 25.98,26.57 IC4.3 | MISC_IO.5 10.9,35.03 10.9,34.11 10.06,33.27 8.23,33.27 7.09,32.13 7.09,26.26 10.13,23.22 10.13,17.81 EXT_IO.2
  Route2 0.152: v21.95,28.78 20.73,28.78 12.72,36.78 MISC_IO.5
RD7  (via drill 0.35)
  Top 0.152: v21.49,24.89 25.98,24.89 IC4.5 | EXT_IO.3 10.9,15.98 9.75,15.98 9.14,16.59 9.14,18.95 6.78,21.31 6.78,34.42 7.7,35.33 9.6,35.33 10.67,36.4 10.67,39.52 12.65,41.5 12.65,41.89 MISC_IO.7
  Route2 0.152: v21.49,24.89 19.81,24.89 EXT_IO.3
RE2
  Top 0.152: IC4.27 37.49,23.37 38.1,23.37 40.23,25.5 40.23,33.05 34.9,38.38 34.21,38.38 28.19,32.36 13.34,32.36 12.72,31.75 MISC_IO.3
RELAY  (via drill 0.35)
  Top 0.152: v27.36,26.34 29.64,26.34 34.21,21.77 37.41,21.77 IC4.25
  Route2 0.152: v27.36,26.34 13.03,26.34 MISC_IO.1
RLED  (via drill 0.35)
  Top 0.152: v24.16,19.41 24.16,19.63 25.45,20.93 25.98,20.93 IC4.10
  Route15 0.152: v24.16,5.08 v24.16,19.41
  Bottom 0.152: v24.16,5.08 25.07,4.17 25.38,4.17 R8.2
SCK1  (via drill 0.35)
  Top 0.152: 33.38,32.66 33.38,35.64 v33.98,36.25 | 33.38,32.66 33.38,29.92 IC4.37 | 33.38,32.66 v29.41,32.66
  Route2 0.152: v29.41,32.66 27.28,30.53 22.94,30.53 15.62,37.85 8.46,37.85 7.85,37.24 7.85,36.4 8.84,35.41 8.84,34.34 DIGITAL.4
  Route15 0.152: v33.98,36.25 50.75,53.01 50.75,54.61 DISPLAY.3
SDI1  (via drill 0.35)
  Top 0.152: v27.89,28.55 28.65,28.55 29.34,29.24 29.34,29.85 IC4.42
  Route2 0.152: v27.89,28.55 22.63,28.55 22.25,28.17 20.27,28.17 12.65,35.79 9.91,35.79 8.91,36.78 DIGITAL.5
SDO1  (via drill 0.35)
  Top 0.152: v24.61,31.14 27.89,31.14 28.5,30.53 28.5,29.92 IC4.43
  Route2 0.152: v24.61,31.14 24,31.14 23.7,30.84 23.09,30.84 15.54,38.38 9.91,38.38 8.91,39.37 DIGITAL.6
  Route15 0.152: DISPLAY.4 47.17,54.61 45.26,56.52 30.94,56.52 28.96,54.53 28.96,35.48 v24.61,31.14
UC_RX  (via drill 0.35)
  Top 0.152: v21.11,29.77 22.86,29.77 24.46,28.17 25.98,28.17 IC4.1
  Route15 0.152: v21.11,29.77 21.11,35.18 14.02,42.27 14.02,44.55 12.57,46 12.27,46 8.91,49.35 8.91,49.5 DIGITAL.10
UC_TX  (via drill 0.35)
  Top 0.152: v23.39,31.44 24.92,29.92 27.74,29.92 IC4.44
  Route2 0.152: v23.39,31.44 22.94,31.44 13.49,40.89 9.91,40.89 DIGITAL.7
V+  (via drill 0.35)
  Top 0.305: v45.57,32.82 45.57,28.25 53.34,20.47 PVP_0.2 52.12,15.29 52.12,9.96 PVP_90.2
  Bottom 0.305: v45.57,32.82 45.57,34.27 R12.2
V+BUS  (via drill 0.35)
  Top 0.305: v47.02,35.41 49.68,38.08 50.75,38.08 IC2.1
  Bottom 0.305: C15.1 52.96,34.34 52.96,35.03 50.83,37.16 50.83,38.08 IC2.1 | 46.94,35.33 47.93,34.34 48.39,34.34 R12.1 | 46.94,35.33 45.49,36.78 42.9,36.78 C14.1 | v47.02,35.41 46.94,35.33
VDD  (via drill 0.35)
  Top 0.305: IC4.28 35.2,24.13 33.91,25.43 v33.91,26.34 | IC4.7 26.06,23.29 26.75,23.29 27.13,22.91 27.13,15.37 28.8,13.69 28.8,13 29.34,12.47 32.69,12.47 33.68,11.48 36.8,11.48 TTL_SERIAL.4 | v12.34,11.1 12.34,11.02 10.21,8.89 10.21,8.51 OS1_10MHZ.4 | OS1_10MHZ.1 10.21,4.32 10.21,8.36 OS1_10MHZ.4 | OS1_10MHZ.4 10.13,8.89 9.07,8.89 5.41,12.55 2.9,12.55 1.98,13.46 1.98,19.56 3.81,21.39 ANALOG.8 3.73,21.69 3.73,21.92 1.68,23.98 1.68,41.05 ICSP.2 7.32,43.18 8.53,44.4 8.84,44.4 DIGITAL.8 8.99,44.55 10.52,44.55 11.89,45.92 14.17,45.92 15.7,47.45 | v51.74,32.28 51.74,33.96 IC2.3 56.16,38.38 56.16,46.99 C13.1 56.08,47.07 55.09,48.06 49.99,48.06 48.92,46.99 CAN_PWR.2 47.62,47.07 47.62,50.19 43.28,54.53 DISPLAY.6 42.29,54.61 38.56,50.88 C4.1 R6.2 | R6.2 35.13,50.88 35.13,52.25 30.94,56.44 27.43,56.44 25.6,54.61 MODBUS.5 21.49,54.53 19.74,52.78 18.75,52.78 16.69,50.72 16.69,48.44 15.7,47.45 | v34.67,46.99 34.67,50.11 35.2,50.65 R6.2 | 15.7,47.45 v17.45,45.69
  Route15 0.305: v33.91,26.34 33.91,25.27 34.44,24.74 | 34.44,24.74 34.44,23.29 34.67,23.06 34.82,23.06 35.36,22.53 35.36,18.34 37.03,16.66 37.03,11.63 TTL_SERIAL.4 | v51.74,32.28 51.59,32.13 43.05,32.13 35.74,24.82 34.52,24.82 34.44,24.74
  Bottom 0.305: C11.1 32.77,22.91 32.77,24.66 33.83,25.73 33.83,26.26 v33.91,26.34 33.6,26.64 32.77,26.64 C6.1 32.69,26.8 C5.1 | v12.34,11.1 12.34,12.7 C3.1 | v51.74,32.28 51.74,30.53 ZENER.C | 17.53,45.69 17.53,45.01 18.67,43.87 18.67,43.18 C2.1 18.82,43.1 18.82,42.49 21.26,40.06 C12.1 | 17.53,45.69 17.53,46.99 R2.1 | IC3.3 30.71,41.28 30.71,42.49 IC3.2 30.86,42.49 32.61,44.25 32.61,46.91 C19.1 v34.67,46.99 C18.1 | v17.45,45.69 17.53,45.69
VREF  (via drill 0.35)
  Top 0.152: v35.59,17.12 35.74,17.27 35.74,18.34 IC4.22
  Route2 0.152: v35.59,17.12 34.82,17.12 31.77,14.07 21.57,14.07 16.38,8.89 ANALOG.3
VSS  (via drill 0.35)
  Top 0.305: LED3.C 29.18,6.15 25.53,6.15 LED2.C 25.38,6.15 21.64,6.15 LED1.C 21.49,6.07 20.04,6.07 v16.51,2.54 | IC4.6 27.96,24.13 29.18,25.35 v29.21,25.4 | v39.62,25.81 38.79,24.97 37.49,24.97 IC4.29 | C4.2 35.81,46.3 34.37,46.3 27.96,52.7 27.96,54.61 R_RESET.1 | DISPLAY.5 47.55,52.78 52.27,52.78 58.06,46.99 C13.2 | MODBUS.1 10.21,53.39 5.87,53.39 RESET.2
  Route2 0.305: v39.62,25.81 42.22,28.4 PVP_0.10
  other vias: 27.94,33.02 21.59,35.56 19.05,21.59 12.7,10.16 12.7,6.35 12.7,2.54 8.89,12.7 8.89,2.54 8.89,10.16
  pour Bottom (rank 6, no thermals): 1.27,1.27 59.69,1.27 59.69,57.15 2.54,57.15 1.27,55.88
  pour Top (no thermals): 7.7,1.35 17.7,1.35 17.7,13.89 7.7,13.89

### Text on the board
Top: Q84 DCU 1.4